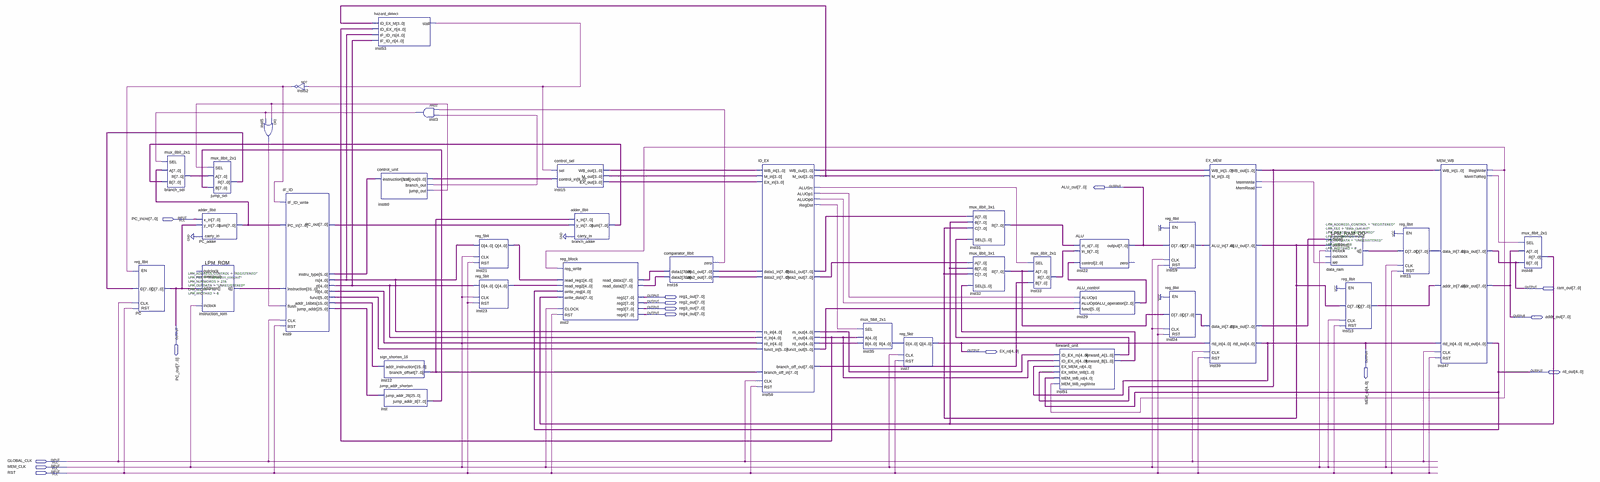
[diagram p0: schematic sheet, whole]
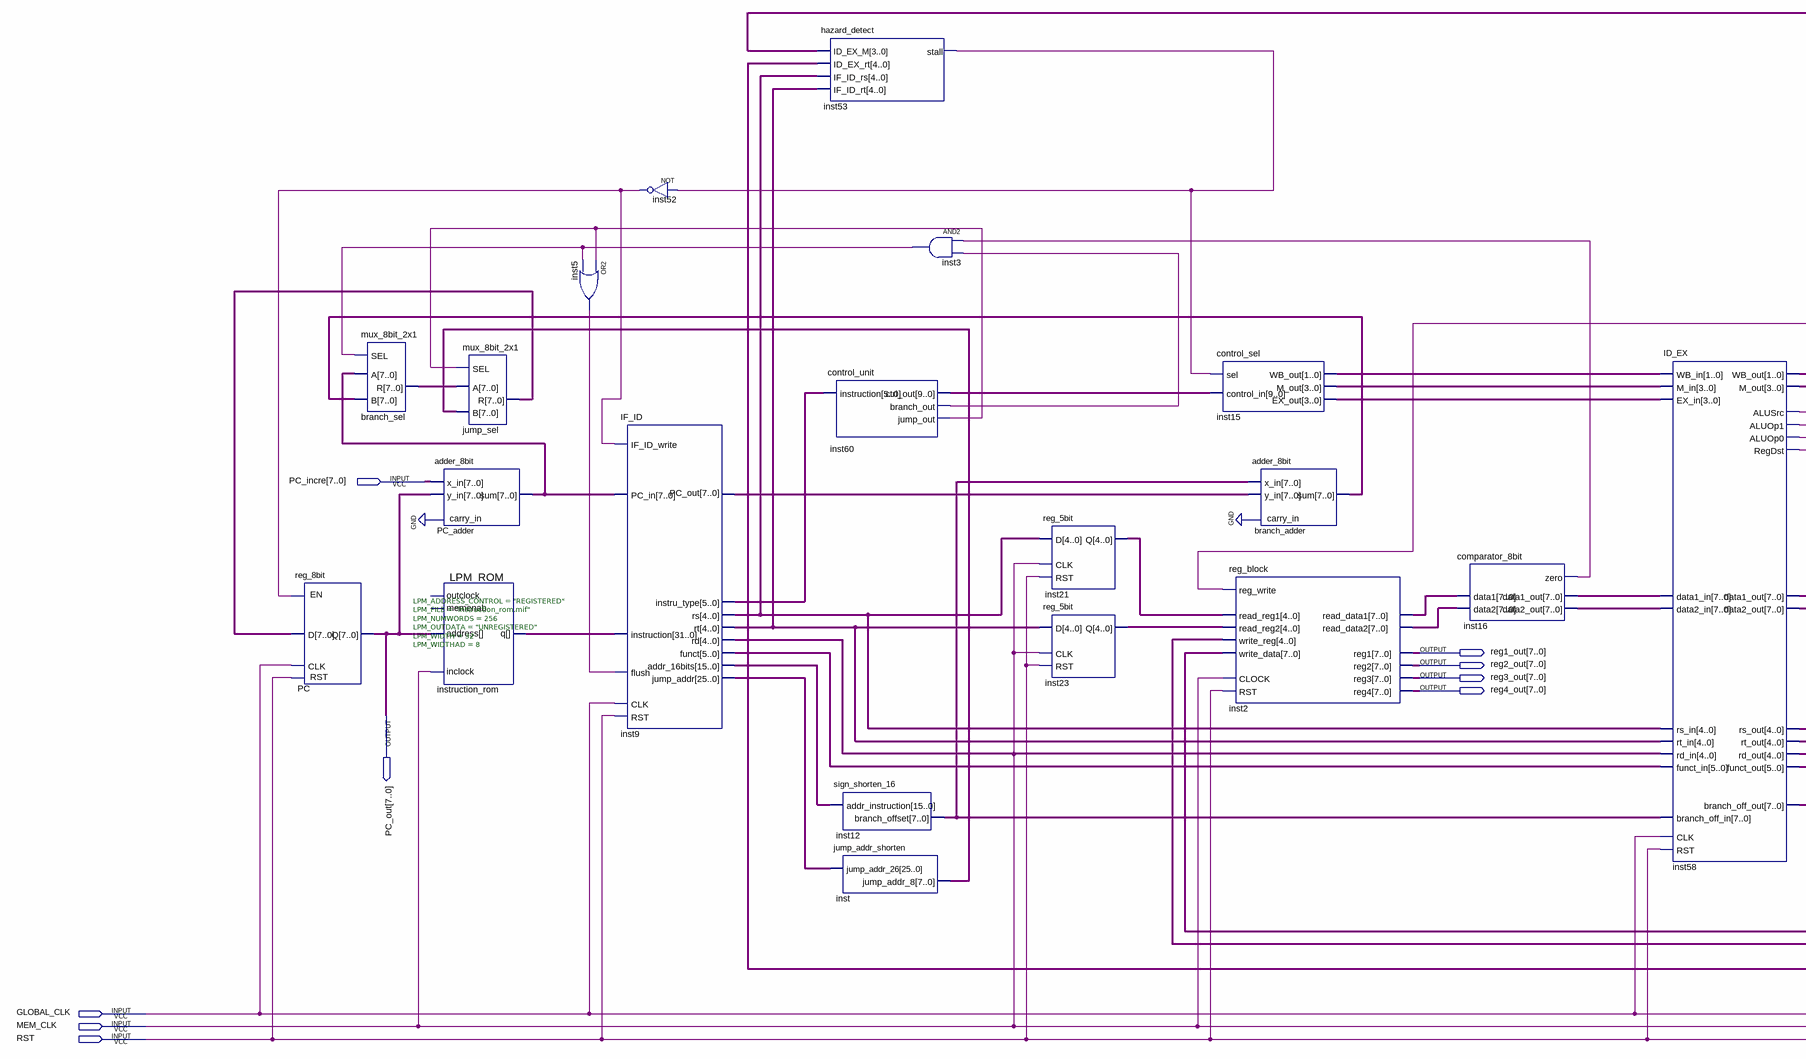
[diagram p1: schematic sheet, left part]
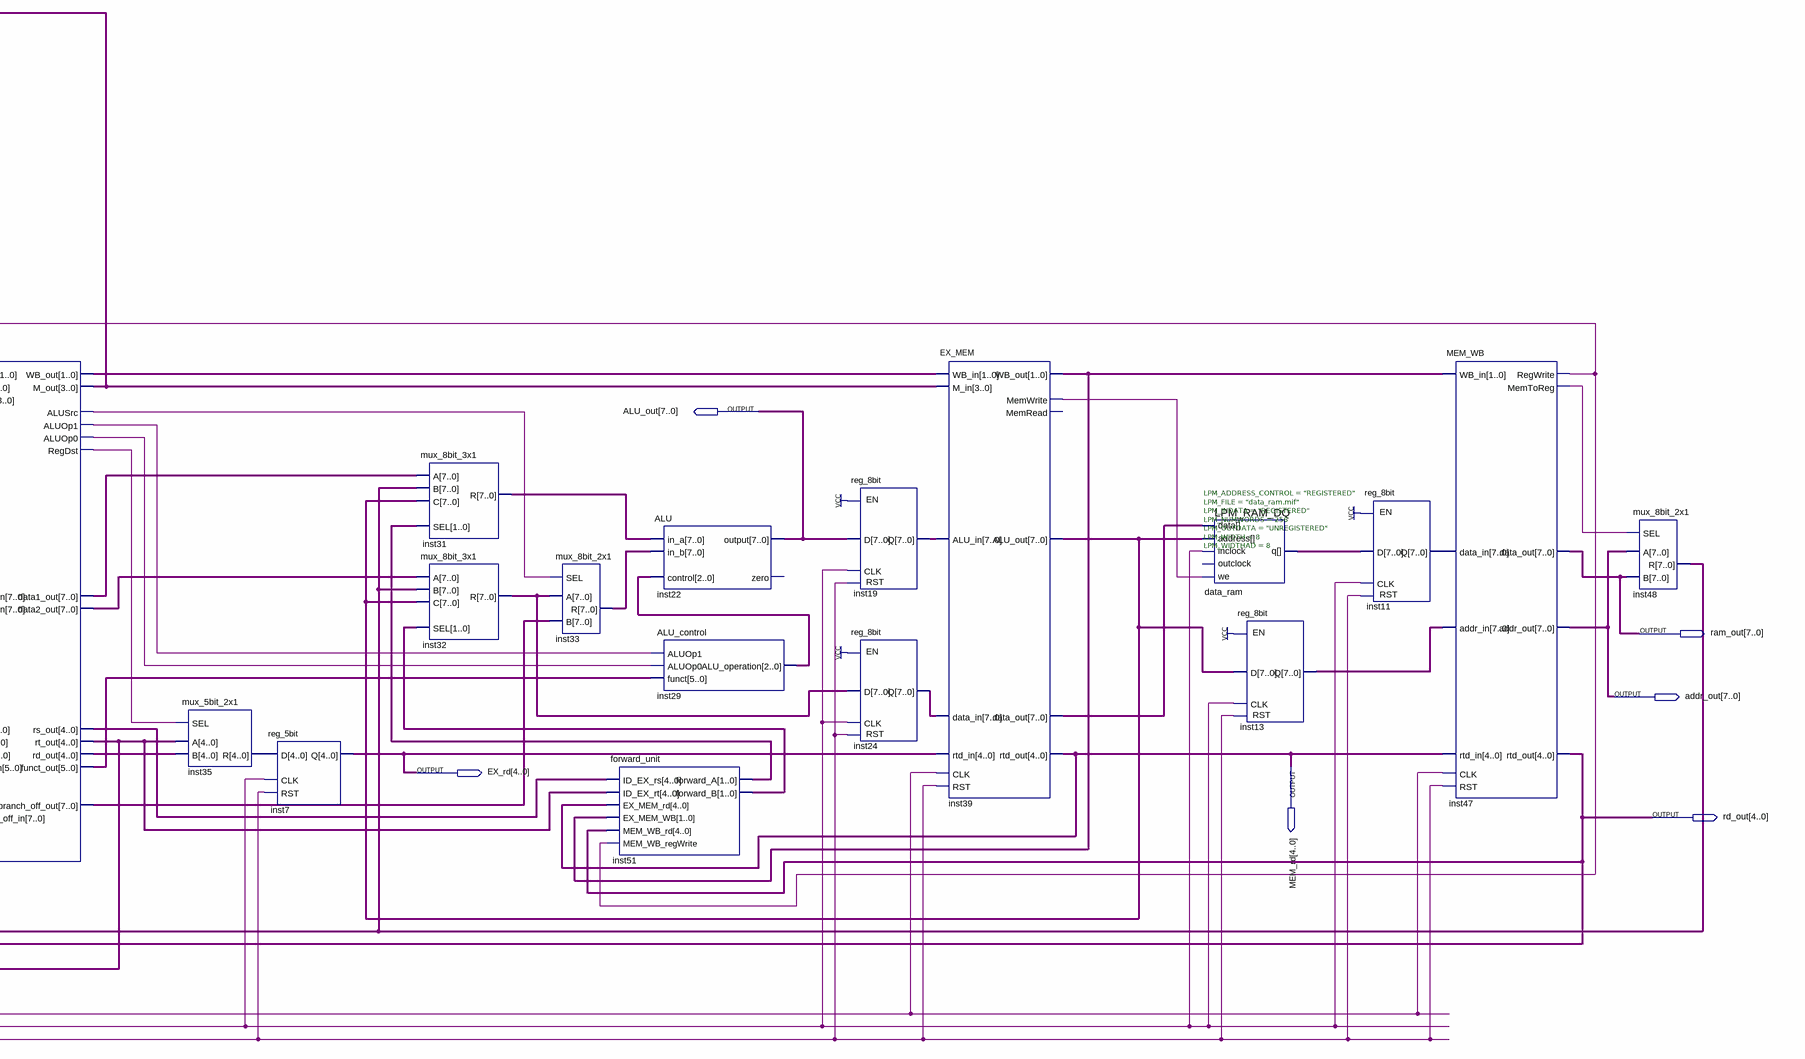
[diagram p2: schematic sheet, right part]
// Quartus schematic top.bdf as structural Verilog: 36 symbols, 15 pins
module top (
  input  [7:0] PC_incre,
  input  GLOBAL_CLK,
  input  MEM_CLK,
  input  RST,
  output [7:0] ALU_out,
  output [7:0] ram_out,
  output [7:0] reg1_out,
  output [7:0] reg2_out,
  output [7:0] reg3_out,
  output [7:0] reg4_out,
  output [7:0] addr_out,
  output [7:0] PC_out,
  output [4:0] MEM_rd,
  output [4:0] EX_rd,
  output [4:0] rd_out
);

  wire inst3_out, inst5_out, inst16_zero, inst39_memwrite, inst47_memtoreg, inst47_regwrite, inst52_out,
       inst53_stall, inst58_aluop0, inst58_aluop1, inst58_alusrc, inst58_regdst, inst60_branch_out,
       inst60_jump_out;
  wire [1:0] inst15_wb_out, inst39_wb_out, inst51_forward_a, inst51_forward_b, inst58_wb_out;
  wire [2:0] inst29_alu_operation;
  wire [3:0] inst15_ex_out, inst15_m_out, inst58_m_out;
  wire [4:0] inst9_rd, inst9_rs, inst9_rt, inst21_q, inst23_q, inst35_r, inst58_rd_out, inst58_rs_out,
       inst58_rt_out;
  wire [5:0] inst9_funct, inst9_instru_type, inst58_funct_out;
  wire [7:0] branch_adder_sum, branch_sel_r, data_ram_q, inst2_read_data1, inst2_read_data2, inst9_pc_out,
       inst11_q, inst12_branch_offset, inst13_q, inst16_data1_out, inst16_data2_out, inst19_q, inst24_q,
       inst31_r, inst32_r, inst33_r, inst39_alu_out, inst39_data_out, inst48_r, inst58_branch_off_out,
       inst58_data1_out, inst58_data2_out, inst_jump_addr_8, jump_sel_r, PC_adder_sum;
  wire [9:0] inst60_ctrl_out;
  wire [15:0] inst9_addr_16bits;
  wire [25:0] inst9_jump_addr;
  wire [31:0] instruction_rom_q;

  reg_8bit PC (.D(jump_sel_r), .EN(inst52_out), .CLK(GLOBAL_CLK), .RST(RST), .Q(PC_out));
  mux_8bit_2x1 branch_sel (.A(PC_adder_sum), .B(branch_adder_sum), .SEL(inst3_out), .R(branch_sel_r));
  mux_8bit_2x1 jump_sel (.A(branch_sel_r), .B(inst_jump_addr_8), .SEL(inst60_jump_out), .R(jump_sel_r));
  adder_8bit PC_adder (.x_in(PC_incre), .y_in(PC_out), .carry_in(1'b0), .sum(PC_adder_sum));
  LPM_ROM #(.LPM_ADDRESS_CONTROL("REGISTERED"), .LPM_FILE("instruction_rom.mif"), .LPM_NUMWORDS(256), .LPM_OUTDATA("UNREGISTERED"), .LPM_WIDTH(32), .LPM_WIDTHAD(8)) instruction_rom (
    .address(PC_out), .inclock(MEM_CLK), .q(instruction_rom_q));  // open: outclock, memenab
  or inst5 (inst5_out, inst60_jump_out, inst3_out);
  IF_ID inst9 (
    .IF_ID_write(inst52_out), .PC_in(PC_adder_sum), .instruction(instruction_rom_q), .flush(inst5_out),
    .CLK(GLOBAL_CLK), .RST(RST), .PC_out(inst9_pc_out), .instru_type(inst9_instru_type), .rs(inst9_rs),
    .rt(inst9_rt), .rd(inst9_rd), .funct(inst9_funct), .addr_16bits(inst9_addr_16bits),
    .jump_addr(inst9_jump_addr));
  not inst52 (inst52_out, inst53_stall);
  hazard_detect inst53 (
    .ID_EX_M(inst58_m_out), .ID_EX_rt(inst58_rt_out), .IF_ID_rs(inst9_rs), .IF_ID_rt(inst9_rt),
    .stall(inst53_stall));
  control_unit inst60 (
    .instruction(inst9_instru_type), .ctrl_out(inst60_ctrl_out), .branch_out(inst60_branch_out),
    .jump_out(inst60_jump_out));
  sign_shorten_16 inst12 (.addr_instruction(inst9_addr_16bits), .branch_offset(inst12_branch_offset));
  jump_addr_shorten inst (.jump_addr_26(inst9_jump_addr), .jump_addr_8(inst_jump_addr_8));
  and inst3 (inst3_out, inst16_zero, inst60_branch_out);
  reg_5bit inst21 (.D(inst9_rs), .CLK(MEM_CLK), .RST(RST), .Q(inst21_q));
  reg_5bit inst23 (.D(inst9_rt), .CLK(MEM_CLK), .RST(RST), .Q(inst23_q));
  control_sel inst15 (
    .sel(inst53_stall), .control_in(inst60_ctrl_out), .WB_out(inst15_wb_out), .M_out(inst15_m_out),
    .EX_out(inst15_ex_out));
  reg_block inst2 (
    .CLOCK(MEM_CLK), .RST(RST), .reg_write(inst47_regwrite), .read_reg1(inst21_q), .read_reg2(inst23_q),
    .write_reg(rd_out), .write_data(inst48_r), .reg1(reg1_out), .reg2(reg2_out), .reg3(reg3_out),
    .reg4(reg4_out), .read_data1(inst2_read_data1), .read_data2(inst2_read_data2));
  adder_8bit branch_adder (.x_in(inst12_branch_offset), .y_in(inst9_pc_out), .carry_in(1'b0), .sum(branch_adder_sum));
  comparator_8bit inst16 (
    .data1(inst2_read_data1), .data2(inst2_read_data2), .zero(inst16_zero), .data1_out(inst16_data1_out),
    .data2_out(inst16_data2_out));
  ID_EX inst58 (
    .WB_in(inst15_wb_out), .M_in(inst15_m_out), .EX_in(inst15_ex_out), .data1_in(inst16_data1_out),
    .data2_in(inst16_data2_out), .rs_in(inst9_rs), .rt_in(inst9_rt), .rd_in(inst9_rd),
    .funct_in(inst9_funct), .branch_off_in(inst12_branch_offset), .CLK(GLOBAL_CLK), .RST(RST),
    .WB_out(inst58_wb_out), .M_out(inst58_m_out), .ALUSrc(inst58_alusrc), .ALUOp1(inst58_aluop1),
    .ALUOp0(inst58_aluop0), .RegDst(inst58_regdst), .data1_out(inst58_data1_out),
    .data2_out(inst58_data2_out), .rs_out(inst58_rs_out), .rt_out(inst58_rt_out), .rd_out(inst58_rd_out),
    .funct_out(inst58_funct_out), .branch_off_out(inst58_branch_off_out));
  mux_5bit_2x1 inst35 (.A(inst58_rt_out), .B(inst58_rd_out), .SEL(inst58_regdst), .R(inst35_r));
  reg_5bit inst7 (.D(inst35_r), .CLK(MEM_CLK), .RST(RST), .Q(EX_rd));
  mux_8bit_3x1 inst31 (.A(inst58_data1_out), .B(inst48_r), .C(inst39_alu_out), .SEL(inst51_forward_a), .R(inst31_r));
  mux_8bit_3x1 inst32 (.A(inst58_data2_out), .B(inst48_r), .C(inst39_alu_out), .SEL(inst51_forward_b), .R(inst32_r));
  mux_8bit_2x1 inst33 (.A(inst32_r), .B(inst58_branch_off_out), .SEL(inst58_alusrc), .R(inst33_r));
  forward_unit inst51 (
    .ID_EX_rs(inst58_rs_out), .ID_EX_rt(inst58_rt_out), .EX_MEM_rd(MEM_rd), .EX_MEM_WB(inst39_wb_out),
    .MEM_WB_rd(rd_out), .MEM_WB_regWrite(inst47_regwrite), .forward_A(inst51_forward_a),
    .forward_B(inst51_forward_b));
  ALU inst22 (.in_a(inst31_r), .in_b(inst33_r), .control(inst29_alu_operation), .\output (ALU_out));  // open: zero
  ALU_control inst29 (
    .funct(inst58_funct_out), .ALUOp1(inst58_aluop1), .ALUOp0(inst58_aluop0),
    .ALU_operation(inst29_alu_operation));
  reg_8bit inst19 (.D(ALU_out), .EN(1'b1), .CLK(MEM_CLK), .RST(RST), .Q(inst19_q));
  reg_8bit inst24 (.D(inst32_r), .EN(1'b1), .CLK(MEM_CLK), .RST(RST), .Q(inst24_q));
  EX_MEM inst39 (
    .WB_in(inst58_wb_out), .M_in(inst58_m_out), .ALU_in(inst19_q), .data_in(inst24_q), .rtd_in(EX_rd),
    .CLK(GLOBAL_CLK), .RST(RST), .WB_out(inst39_wb_out), .MemWrite(inst39_memwrite),
    .ALU_out(inst39_alu_out), .data_out(inst39_data_out), .rtd_out(MEM_rd));  // open: MemRead
  LPM_RAM_DQ #(.LPM_ADDRESS_CONTROL("REGISTERED"), .LPM_FILE("data_ram.mif"), .LPM_INDATA("REGISTERED"), .LPM_NUMWORDS(256), .LPM_OUTDATA("UNREGISTERED"), .LPM_WIDTH(8), .LPM_WIDTHAD(8)) data_ram (
    .inclock(MEM_CLK), .data(inst39_data_out), .address(inst39_alu_out), .we(inst39_memwrite), .q(data_ram_q));  // open: outclock
  reg_8bit inst13 (.D(inst39_alu_out), .EN(1'b1), .CLK(MEM_CLK), .RST(RST), .Q(inst13_q));
  reg_8bit inst11 (.D(data_ram_q), .EN(1'b1), .CLK(MEM_CLK), .RST(RST), .Q(inst11_q));
  MEM_WB inst47 (
    .WB_in(inst39_wb_out), .data_in(inst11_q), .addr_in(inst13_q), .rtd_in(MEM_rd), .CLK(GLOBAL_CLK),
    .RST(RST), .RegWrite(inst47_regwrite), .MemToReg(inst47_memtoreg), .data_out(ram_out),
    .addr_out(addr_out), .rtd_out(rd_out));
  mux_8bit_2x1 inst48 (.A(addr_out), .B(ram_out), .SEL(inst47_memtoreg), .R(inst48_r));
endmodule
